# EAGLE design riffle-beta-0.1.3.2 (EAGLE 7.5.0)
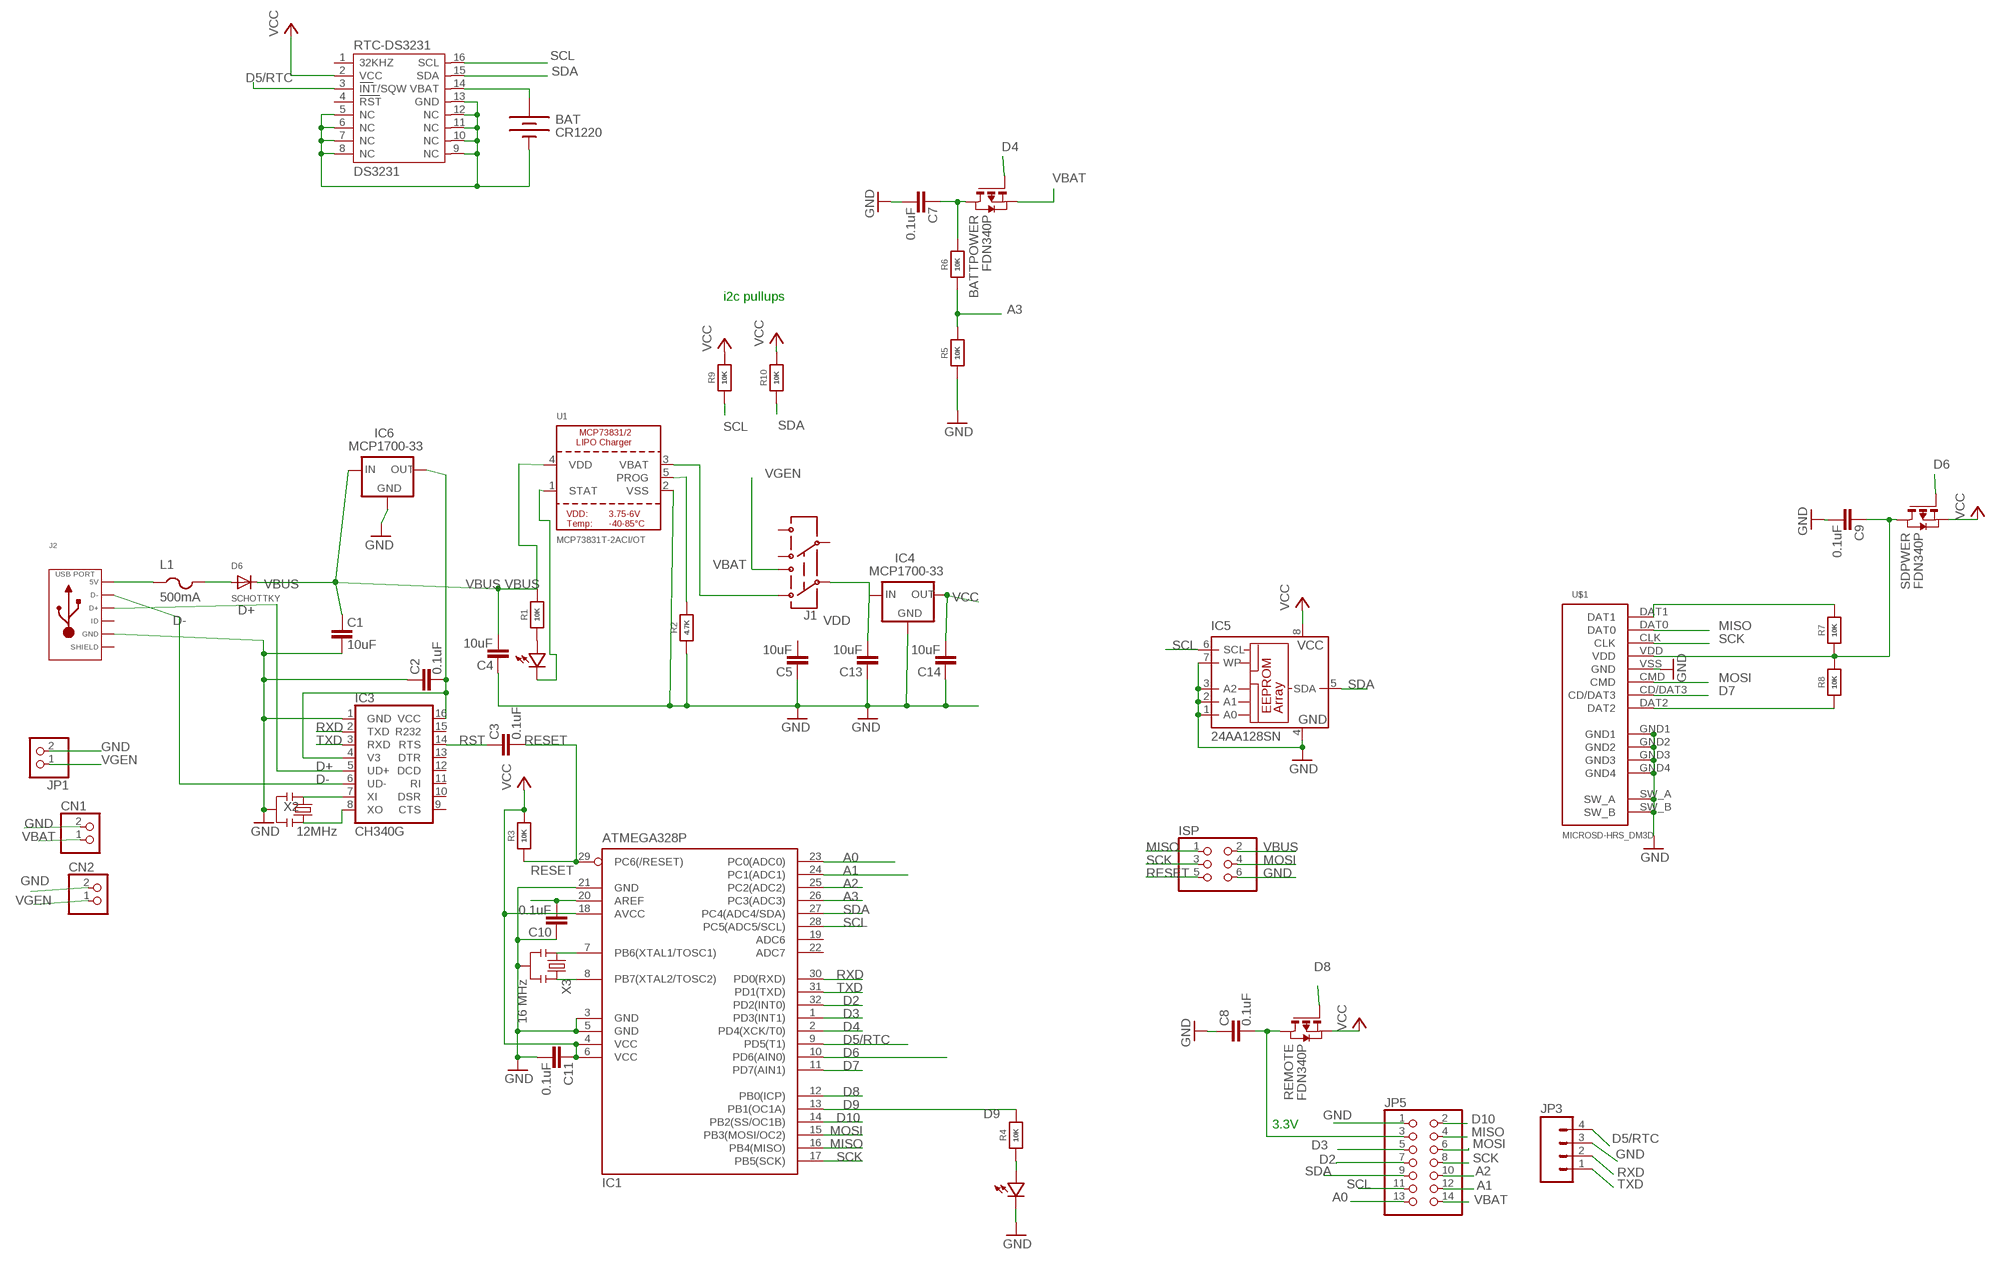
[diagram p0: schematic, sheet 1]

## Parts
BAT  CR1220  BATTERYBATTERY_12MM_SMT  [BATTCON_12MM_SMT]
BATTPOWER  FDN340P  PMOSSOT23  [SOT-23]
C1  10uF  CAP0603-CAP  [0603-CAP]
C2  0.1uF  CAP0603-CAP  [0603-CAP]
C3  0.1uF  CAP0603-CAP  [0603-CAP]
C4  10uF  CAP0603-CAP  [0603-CAP]
C5  10uF  CAP0603-CAP  [0603-CAP]
C7  0.1uF  CAP0603-CAP  [0603-CAP]
C8  0.1uF  CAP0603-CAP  [0603-CAP]
C9  0.1uF  CAP0603-CAP  [0603-CAP]
C10  0.1uF  CAP0603-CAP  [0603-CAP]
C11  0.1uF  CAP0603-CAP  [0603-CAP]
C13  10uF  CAP0603-CAP  [0603-CAP]
C14  10uF  CAP0603-CAP  [0603-CAP]
CN1  JST_2PIN-SMT-RA  [JST-PH-2-SMT-RA]
CN2  JST_2PIN-SMT-RA  [JST-PH-2-SMT-RA]
D1  LED0603  [0603-LED]
D2  LED0603  [0603-LED]
D6  SCHOTTKY  DIODE_SOD-123FL  [SOD-123FL]
IC1  ATMEGA328P  MEGA8-AI  [TQFP32-08]
IC3  CH340G  [SO16]
IC4  MCP1700-33  MCP1700SOT89  [SOT89]
IC5  24AA128SN  [SO-08]
IC6  MCP1700-33  MCP1700SOT89  [SOT89]
ISP  PINHD-2X3  [2X03]
J1  AYZ0202  [AYZ0202]
J2  USB_MICRO_RIGHT  [MICROUSB-RIGHT]
JP1  PINHD-1X2  [1X02]
JP3  M04SMD  [1X04-SMD]
JP5  PINHD-2X7  [2X07]
L1  500mA  PTCFUSE-1206  [R1206]
R1  10K  RESISTOR_0603_NOOUT  [0603-NO]
R2  4.7K  RESISTOR_0603_NOOUT  [0603-NO]
R3  10K  RESISTOR_0603_NOOUT  [0603-NO]
R4  10K  RESISTOR_0603_NOOUT  [0603-NO]
R5  10K  RESISTOR_0603_NOOUT  [0603-NO]
R6  10K  RESISTOR_0603_NOOUT  [0603-NO]
R7  10K  RESISTOR_0603_NOOUT  [0603-NO]
R8  10K  RESISTOR_0603_NOOUT  [0603-NO]
R9  10K  RESISTOR_0603_NOOUT  [0603-NO]
R10  10K  RESISTOR_0603_NOOUT  [0603-NO]
REMOTE  FDN340P  PMOSSOT23  [SOT-23]
RTC-DS3231  DS3231  [DS3231]
SDPWER  FDN340P  PMOSSOT23  [SOT-23]
U1  MCP73831T-2ACI/OT  MCP73831/2  [SOT23-5]
U$1  MICROSD-HRS_DM3D  [DM3D]
X2  12MHz  RESONATORSMD  [RESONATOR-SMD]
X3  16 MHz  RESONATORSMD  [RESONATOR-SMD]

## Nets
A0: IC1.23(PC0(ADC0)) JP5.13
A1: IC1.24(PC1(ADC1)) JP5.12
A2: IC1.25(PC2(ADC2)) JP5.10
A3: IC1.26(PC3(ADC3)) R5.2 R6.1
AREF: C10.1 IC1.20(AREF)
D2: IC1.32(PD2(INT0)) JP5.7
D3: IC1.1(PD3(INT1)) JP5.5
D4: BATTPOWER.3(G) IC1.2(PD4(XCK/T0))
D5/RTC: IC1.9(PD5(T1)) JP3.4 RTC-DS3231.3(INT/SQW)
D6: IC1.10(PD6(AIN0)) SDPWER.3(G)
D7: IC1.11(PD7(AIN1)) U$1.CD/DAT3
D8: IC1.12(PB0(ICP)) REMOTE.3(G)
D9: IC1.13(PB1(OC1A)) R4.2
D10: IC1.14(PB2(SS/OC1B)) JP5.2
D+: IC3.5(UD+) J2.3(D+)
D-: IC3.6(UD-) J2.2(D-)
GND: BAT.P$1(-) C1.1 C2.2 C4.2 C5.2 C7.1 C8.2 C9.1 C10.2 C11.1 C13.2 C14.2 CN1.2 CN2.2 D2.MINUS IC1.3(GND) IC1.5(GND) IC1.21(GND) IC3.1(GND) IC4.1(GND) IC5.1(A0) IC5.2(A1) IC5.3(A2) IC5.4(GND) IC5.7(WP) IC6.1(GND) ISP.6 J2.5(GND) JP1.2 JP3.3 JP5.1 R2.1 R5.1 RTC-DS3231.5(NC) RTC-DS3231.6(NC) RTC-DS3231.7(NC) RTC-DS3231.8(NC) RTC-DS3231.9(NC) RTC-DS3231.10(NC) RTC-DS3231.11(NC) RTC-DS3231.12(NC) RTC-DS3231.13(GND) U1.2(VSS) U$1.GND1 U$1.GND2 U$1.GND3 U$1.GND4 U$1.SW_A U$1.SW_B U$1.VSS(GND) X2.2 X3.2
MISO: IC1.16(PB4(MISO)) ISP.1 JP5.4 U$1.DAT0
MOSI: IC1.15(PB3(MOSI/OC2)) ISP.4 JP5.6 U$1.CMD
N$1: D1.PLUS R1.1
N$2: IC1.7(PB6(XTAL1/TOSC1)) X3.1
N$3: IC1.8(PB7(XTAL2/TOSC2)) X3.3
N$4: C9.2 R7.1 R8.2 SDPWER.1(D) U$1.VDD
N$5: D1.MINUS U1.1(STAT)
N$6: R2.2 U1.5(PROG)
N$7: C8.1 JP5.3 REMOTE.1(D)
N$8: C2.1 IC3.4(V3) IC3.16(VCC) IC6.3(OUT)
N$9: J2.1(5V) L1.1
N$10: D6.A L1.2
N$11: IC3.7(XI) X2.1
N$13: IC3.8(XO) X2.3
N$15: BATTPOWER.1(D) C7.2 R6.2
N$16: R7.2 U$1.DAT1
N$17: D2.PLUS R4.1
N$18: R8.1 U$1.DAT2
RESET: C3.1 IC1.29(PC6(/RESET)) ISP.5 R3.1
RST: C3.2 IC3.14(RTS)
RTC_BATT: BAT.P$2(+) RTC-DS3231.14(VBAT)
RXD: IC1.30(PD0(RXD)) IC3.2(TXD) JP3.2
SCK: IC1.17(PB5(SCK)) ISP.3 JP5.8 U$1.CLK
SCL: IC1.28(PC5(ADC5/SCL)) IC5.6(SCL) JP5.11 R9.1 RTC-DS3231.16(SCL)
SDA: IC1.27(PC4(ADC4/SDA)) IC5.5(SDA) JP5.9 R10.1 RTC-DS3231.15(SDA)
TXD: IC1.31(PD1(TXD)) IC3.3(RXD) JP3.1
VBAT [vcc]: BATTPOWER.2(S) CN1.1 J1.3 JP5.14 U1.3(VBAT)
VBUS [vcc]: C1.2 C4.1 D6.C IC6.2(IN) ISP.2 R1.2 U1.4(VDD)
VCC: C11.2 C14.1 IC1.4(VCC) IC1.6(VCC) IC1.18(AVCC) IC4.3(OUT) IC5.8(VCC) R3.2 R9.2 R10.2 REMOTE.2(S) RTC-DS3231.2(VCC) SDPWER.2(S)
VDD: C13.1 IC4.2(IN) J1.2
VGEN: CN2.1 J1.1 JP1.1
Unconnected: C5.1 IC1.19(ADC6) IC1.22(ADC7) IC3.9(CTS) IC3.10(DSR) IC3.11(RI) IC3.12(DCD) IC3.13(DTR) IC3.15(R232) J1.4 J1.5 J1.6 J2.4(ID) RTC-DS3231.1(32KHZ) RTC-DS3231.4(RST)

## Notes on the sheet
- i2c pullups
- 3.3V

## Power pins joined to a net without a drawn wire
SLD: J2.S1(SLD) J2.S2(SLD) J2.S3(SLD) J2.S4(SLD) J2.S5(SLD) J2.S6(SLD) J2.S7(SLD) J2.S8(SLD)

## Library data of the parts
BAT = SparkFunNew:BATTERY: Battery Holders Various common sizes : AA, AAA, 20mm coin cell and 12mm coin cell.
BATTPOWER REMOTE SDPWER = zetex:PMOSSOT23: MOS FET; OC_FARNELL: unknown; OC_NEWARK: unknown
C1-C5 C7-C11 C13 C14 = SparkFun:CAP: Capacitor Standard 0603 ceramic capacitor, and 0.1" leaded capacitor.
CN1 CN2 = adafruit:JST_2PIN: JST 2-Pin Connectors of various flavors SMT-RA (S2B-PH-SM4) 4UConnector #17311 SMT (B2B-PH-SM4) THM-RA (S2B-PH) THM (B2B-PH)
D1 D2 = LowPowerLab:LED
D6 = adafruit:DIODE: Diode SMADIODE - SMA Surface Mount Package 20V 1A Schottky Diode Digikey: 641-1014-6-ND DO-1N4148 - Through Hole Small Current Diode SOD-123 20V 1 A (.5mV Vf) Schottky Diode - Digikey: MBRX120TPMSCT-ND SOD-323 10V 570mA (.38mV Vf, 3ns) Schottky Diode - Digikey: ZLLS410CT-ND SOD-523 30V 30mA Schottky Diode (RB751S-40TE61) - Digikey: RB751S-40TE61CT-ND SOT23-R/W - SOT23 Package (R = Solder Paste/Reflow Ovens, W = Hand-Soldering) BAT54Film 40V 300mA - Digikey: 497-7162-1-ND
IC1 = atmel:MEGA8: MICROCONTROLLER 8 Kbytes FLASH, 1 kbytes SRAM, 512 bytes EEPROM, USART, 6-channel 10 bit ADC, 2-channel 8 bit ADC Pin compatible with Atmega48, ATMega88, ATMega168 Source: avr.lbr; MPN: ATMEGA8-16AU; OC_FARNELL: 9171371; OC_NEWARK: 73M8863
IC3 = SparkFunNew:CH340
IC4 IC6 = adafruit:MCP1700: VOLTAGE REGULATOR
IC5 = microchip:24*: Serial EEPROM I2C; MF: MICROCHIP; MPN: 24AA128-I/SN; OC_FARNELL: unknown; OC_NEWARK: 92C6842
ISP = pinhead:PINHD-2X3: PIN HEADER
J1 = SparkFunNew:AYZ0202: SPDT Slide Switch Simple SMD single-pull double-throw slide switch. Good for less than 350mA power switch, switching UARTs between devices, etc. Spark Fun Electronics SKU : COM-00597
J2 = MF_Connectors:USB: Library: MF_Connectors Description: 5 Pin USB Connectors. SLD is the shield connection. Usually tied to ground through a small ferrite bead.
JP1 = pinhead:PINHD-1X2: PIN HEADER
JP3 = SparkFun:M04: Header 4 Standard 4-pin 0.1" header. Use with straight break away headers (SKU : PRT-00116), right angle break away headers (PRT-00553), swiss pins (PRT-00743), machine pins (PRT-00117), and female headers (PRT-00115). Molex polarized connector foot print use with SKU : PRT-08231 with associated crimp pins and housings.
JP5 = pinhead:PINHD-2X7: PIN HEADER
L1 = adafruit:PTCFUSE: PTC fuses, resettable thermistors
R1-R10 = microbuilder:RESISTOR: Resistors For new designs, use the packages preceded by an '_' character since they are more reliable: The following footprints should be used on most boards: _0402 - Standard footprint for regular board layouts _0603 - Standard footprint for regular board layouts _0805 - Standard footprint for regular board layouts _1206 - Standard footprint for regular board layouts For extremely tight-pitch boards where space is at a premium, the following 'micro-pitch' footprints can be used (smaller pads, no silkscreen outline, etc.): _0402MP - Micro-pitch footprint for very dense/compact boards _0603MP - Micro-pitch footprint for very dense/compact boards _0805MP - Micro-pitch footprint for very dense/compact boards _1206MP - Micro-pitch footprint for very dense/compact boards
RTC-DS3231 = _lh-library:DS3231
U1 = microbuilder:MCP73831/2: MCP73831/2 LIPO Charger VDD: 3.75 - 6V Temp -40 - 85°C Programmable Charge Rate: 15-500mA NOTE: STAT is a tri-state logic output on the MCP73831 and an open-drain output on the MCP73832. SOT23-5 with 4.2V output and tri-state logic on STAT = MCP73831T-2ACI/OT
U$1 = hrs_DM3D-SF:MICROSD-HRS_DM3D
X2 = SparkFunNew:RESONATOR: Resonator Small SMD resonator. This is the itty bitty 10/20MHz resonators with built in caps. CSTCE10M0G55 and CSTCE20M0V53. Footprint has been reviewed closely but hasn't been tested yet.
X3 = SparkFun:RESONATOR: Resonator Small SMD resonator. This is the itty bitty 10/20MHz resonators with built in caps. CSTCE10M0G55 and CSTCE20M0V53. Footprint has been reviewed closely but hasn't been tested yet.

## Board
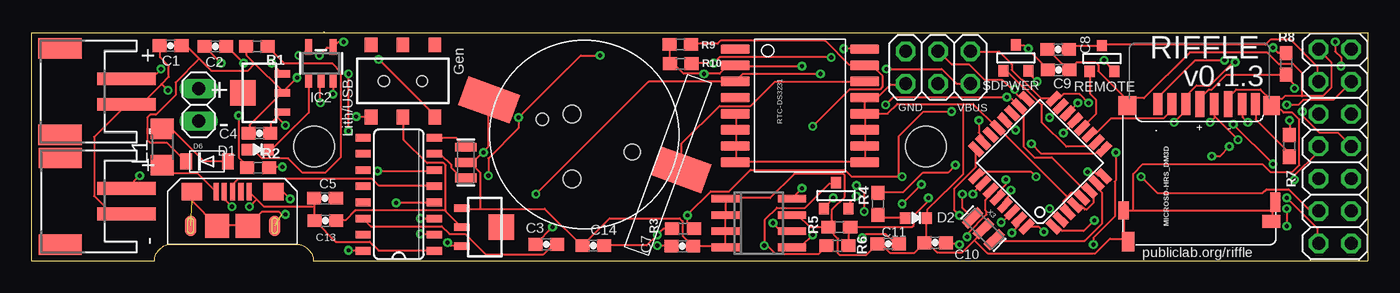
[diagram p1: board, top side]
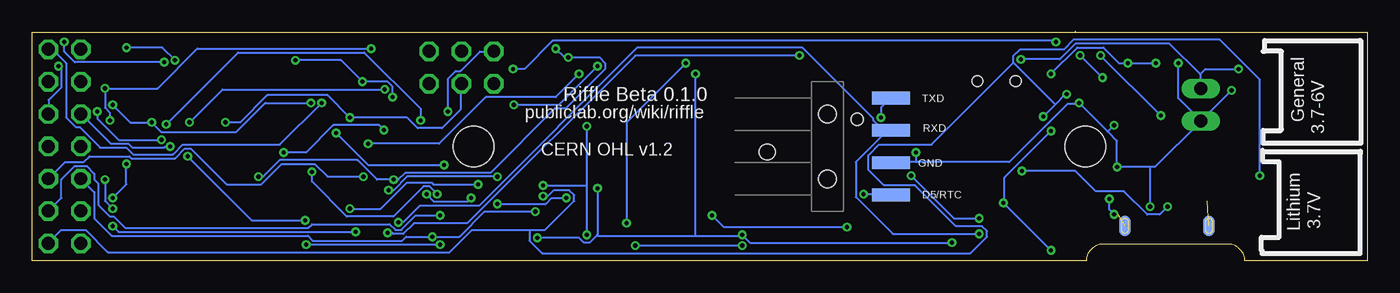
[diagram p2: board, bottom side, seen from below]

Size 104.8 x 18.01 mm. Coordinates in mm from the lower left corner, seen from the top.
Outline: 22.91,18.01 22.96,18.01
Outline: 0,0 0,17.96 104.8,17.96 104.8,0 22.07,0 arc90 20.75,1.32 10.95,1.32 arc90 9.63,0 0,0
Copper layers (1*16): Top 0.0356mm / dielectric 1.5011mm / Bottom 0.0356mm
Design rules "LaenPCBOrder": minimum track width 6mil, minimum drill 13mil, track to track 6mil, track to pad 6mil, pad to pad 6mil, via to via 6mil, smd to smd 6mil, copper to edge 15mil, drill to drill 6mil, minimum pad ring 7mil, minimum via ring 7mil, stop-mask expansion 3mil, vias tented up to drill 0mil, thermal gap 10mil
Holes 3.2 mm at 70.13,9 22.13,9

### Footprints (pad centres in the part's own frame; a part is rotated, then mirrored left to right if it is on the bottom)
BATTCON_12MM_SMT = smd 2.4 x 4.3: P$1 0,11.96 | smd 2.4 x 4.2: P$2 0,-4.1 | hole 0.95: 0,7.5 | hole 1.25: 0,0
SOT-23 = smd 0.787 x 0.889: 1 0.025,-1.016; 2 -0.94,1.016; 3 0.991,1.016
0603-CAP = smd 1.1 x 1: 1 -0.85,0; 2 0.85,0
JST-PH-2-SMT-RA = smd 1 x 4.6: 1 1,-3.7; 2 -1,-3.7 | smd 1.6 x 3.4: NC1 -3.4,1.5; NC2 3.4,1.5
0603-LED = smd 0.8 x 0.9: MINUS -0.85,0; PLUS 0.85,0
SOD-123FL = smd 0.91 x 1.22: A 1.637,0; C -1.637,0
TQFP32-08 = smd 1.27 x 0.559: 1 -4.293,2.8; 2 -4.293,2; 3 -4.293,1.2; 4 -4.293,0.4; 5 -4.293,-0.4; 6 -4.293,-1.2; 7 -4.293,-2; 8 -4.293,-2.8; 17 4.293,-2.8; 18 4.293,-2; 19 4.293,-1.2; 20 4.293,-0.4; 21 4.293,0.4; 22 4.293,1.2; 23 4.293,2; 24 4.293,2.8 | smd 0.559 x 1.27: 9 -2.8,-4.293; 10 -2,-4.293; 11 -1.2,-4.293; 12 -0.4,-4.293; 13 0.4,-4.293; 14 1.2,-4.293; 15 2,-4.293; 16 2.8,-4.293; 25 2.8,4.293; 26 2,4.293; 27 1.2,4.293; 28 0.4,4.293; 29 -0.4,4.293; 30 -1.2,4.293; 31 -2,4.293; 32 -2.8,4.293
SO16 = smd 0.6 x 1.2: 1 -4.445,-2.8; 2 -3.175,-2.8; 3 -1.905,-2.8; 4 -0.635,-2.8; 5 0.635,-2.8; 6 1.905,-2.8; 7 3.175,-2.8; 8 4.445,-2.8; 9 4.445,2.8; 10 3.175,2.8; 11 1.905,2.8; 12 0.635,2.8; 13 -0.635,2.8; 14 -1.905,2.8; 15 -3.175,2.8; 16 -4.445,2.8
SOT89 = smd 0.58 x 1.2: 1 -1.5,-1.8; 2 0,-1.8; 3 1.5,-1.8 | smd 2 x 2: 4 0,1.3
SO-08 = smd 0.6 x 2.2: 1 -1.905,-2.6; 2 -0.635,-2.6; 3 0.635,-2.6; 4 1.905,-2.6; 5 1.905,2.6; 6 0.635,2.6; 7 -0.635,2.6; 8 -1.905,2.6
2X03 = drill 1.016 octagon: 1 -2.54,-1.27; 2 -2.54,1.27; 3 0,-1.27; 4 0,1.27; 5 2.54,-1.27; 6 2.54,1.27
AYZ0202 = smd 1 x 1.15: 1 -2.5,2.825; 2 0,2.825; 3 2.5,2.825; 4 -2.5,-2.825; 5 0,-2.825; 6 2.5,-2.825 | hole 0.85: 1.5,0; -1.5,0
MICROUSB-RIGHT = smd 0.4 x 1.35: 1 -1.3,1.27; 2 -0.65,1.27; 3 0,1.27; 4 0.65,1.27; 5 1.3,1.27 | smd 0.9 x 1.6: S1 -3.3,-1.4; S2 3.3,-1.4 | smd 1.6 x 1.4: S3 -3.2,1.27; S4 3.2,1.27 | smd 1.9 x 1.9: S5 -1.2,-1.405; S6 1.2,-1.405 | smd 0.9 x 1.6 bottom: S7 -3.3,-1.4; S8 3.3,-1.4
1X02 = drill 1.016 long: 1 -1.27,0; 2 1.27,0
1X04-SMD = smd 1 x 3: 1 -3.81,5; 2 -1.27,5; 3 1.27,5; 4 3.81,5 | hole 1.4: -2.54,0; 2.54,0
2X07 = drill 1.016 octagon: 1 -7.62,-1.27; 2 -7.62,1.27; 3 -5.08,-1.27; 4 -5.08,1.27; 5 -2.54,-1.27; 6 -2.54,1.27; 7 0,-1.27; 8 0,1.27; 9 2.54,-1.27; 10 2.54,1.27; 11 5.08,-1.27; 12 5.08,1.27; 13 7.62,-1.27; 14 7.62,1.27
R1206 = smd 1.6 x 1.803: 1 -1.422,0; 2 1.422,0
0603-NO = smd 1.1 x 1: 1 -0.85,0; 2 0.85,0
DS3231 = smd 0.762 x 2.286: 1 -4.445,-5.08; 2 -3.175,-5.08; 3 -1.905,-5.08; 4 -0.635,-5.08; 5 0.635,-5.08; 6 1.905,-5.08; 7 3.175,-5.08; 8 4.445,-5.08; 9 4.445,5.08; 10 3.175,5.08; 11 1.905,5.08; 12 0.635,5.08; 13 -0.635,5.08; 14 -1.905,5.08; 15 -3.175,5.08; 16 -4.445,5.08
SOT23-5 = smd 0.55 x 1.2: 1 -0.95,-1.3; 2 0,-1.3; 3 0.95,-1.3; 4 0.95,1.3; 5 -0.95,1.3
DM3D = smd 0.7 x 1.75: CD/DAT3 8.15,0.45; CLK 4.85,0.45; CMD 7.05,0.45; DAT0 2.65,0.45; DAT1 1.6,0.45; DAT2 9.25,0.45 | smd 0.8 x 1.5: GND1 0.05,8.15 | smd 0.8 x 1.4: GND2 11.95,8.8 | smd 1.4 x 1.5: GND3 11.65,0.55 | smd 1.3 x 1.5: GND4 0.35,0.55 | smd 1 x 1.55: SW_A 11.6,11.25 | smd 1.4 x 1: SW_B 0.35,9.65 | smd 0.7 x 2.032: VDD 5.95,0.45; VSS 3.75,0.45
RESONATOR-SMD = smd 0.7 x 1.7: 1 -1.2,0; 2 0,0; 3 1.2,0

### Placement (x,y rotation side)
BAT  47.1,8.57 70 top
BATTPOWER  63.12,5.14 180 top
C1  10.88,16.92 0 top
C2  14.39,16.86 180 top
C3  40.37,1.31 0 top
C4  17.86,10.04 0 top
C5  23,4.94 180 top
C7  51.03,1.17 180 top
C8  80.53,16.62 180 top
C9  80.57,15.01 180 top
C10  70.86,1.44 180 top
C11  67.19,1.36 0 top
C13  23.04,3.17 180 top
C14  44.04,1.22 180 top
CN1  3.72,4.7 90 top
CN2  3.71,13.31 90 top
D1  17.72,8.76 180 top
D2  69.37,3.38 180 top
D6  13.74,7.82 0 top
IC1  79.09,7.72 135 top
IC3  28.79,5.24 90 top
IC4  35.53,2.67 270 top
IC5  57.02,2.98 270 top
IC6  17.86,13.21 90 top
ISP  71.1,15.2 180 top
J1  29.11,14.14 180 top
J2  15.75,4.17 0 top
JP1  13.09,12.26 270 top
JP3  42.39,9 270 bottom
JP5  102.23,9.01 270 top
L1  10.24,8.97 90 top
R1  17.66,16.87 180 top
R2  17.75,7.34 180 top
R3  51.09,2.55 180 top
R4  66.37,4.5 90 top
R5  63.35,2.66 0 top
R6  63.2,1.22 180 top
R7  98.65,9.05 270 top
R8  98.4,15.49 270 top
R9  50.91,15.5 180 top
R10  50.88,17.03 180 top
REMOTE  83.98,15.91 180 top
RTC-DS3231  60.27,12.21 270 top
SDPWER  77.23,15.95 180 top
U1  22.68,15.52 0 top
U$1  97.6,12.78 180 top
X2  34.06,7.74 90 top
X3  74.66,2.55 135 top

### Tracks (layer width: path | path; a pad name or v marks a point on that pad's centre or on a via)
A0  (via drill 0.33)
  Top 0.152: v74.29,11.05 74.29,10.06 74.6,9.75 74.6,9.37 IC1.23 | v97.38,7.62 v94.26,10.74 | v98.45,4.95 100.89,2.52 100.89,1.45 JP5.13
  Bottom 0.152: v74.29,11.05 74.29,11.96 78.71,16.38 88.62,16.38 v94.26,10.74 | v97.38,7.62 97.38,6.02 v98.45,4.95
A1  (via drill 0.33)
  Top 0.152: v72.77,3.58 72.39,3.96 72.39,5.71 74.07,7.39 74.07,8.76 IC1.24
  Bottom 0.152: v72.77,3.58 74.68,3.58 75.82,2.44 76.28,2.44 76.73,2.9 82.83,2.9 83.13,2.59 97.46,2.59 98.37,3.5 98.68,3.5 99.59,4.42 99.59,6.1 99.9,6.4 99.9,6.86 100.51,7.47 101.42,7.47 102.49,6.4 102.49,4.95 103.48,3.96 JP5.12
A2  (via drill 0.33)
  Top 0.152: v78.79,6.63 78.41,7.01 74.83,7.01 74.52,6.71 74.14,6.71 IC1.25
  Bottom 0.152: v78.79,6.63 81.61,6.63 82.6,7.62 85.19,7.62 86.79,6.02 89.53,6.02 92.35,8.84 92.81,8.84 93.57,8.08 97,8.08 97.15,8.23 100.28,8.23 100.74,7.77 102.18,7.77 103.48,6.48 JP5.10
A3  (via drill 0.33)
  Top 0.152: R6.1 64.08,1.22 64.08,2.52 64.16,2.59 R5.2 64.24,2.67 69.04,2.67 69.19,2.82 69.19,3.58 70.33,4.72 v70.33,4.95 | v73.84,5.26 73.84,5.33 74.6,6.1 IC1.26
  Bottom 0.152: v73.84,5.26 73.23,4.65 70.64,4.65 v70.33,4.95
AREF  (via drill 0.33)
  Top 0.152: v72.77,1.29 72.69,1.37 71.78,1.37 C10.1 | v83.29,1.29 83.29,1.83 84.96,3.5 84.96,6.25 85.04,6.33 v85.04,8.53 | v77.19,10.29 77.04,10.29 76.35,10.97 IC1.20
  Bottom 0.152: v83.29,1.29 v72.77,1.29 | v85.04,8.53 83.29,8.53 81.15,10.67 77.57,10.67 v77.19,10.29
D2  (via drill 0.33)
  Top 0.152: v79.4,2.29 79.02,2.67 78.1,2.67 IC1.32 | v98.45,4.12 v98.45,2.74 | v99.06,6.4 99.06,6.71 100.89,8.53 100.89,8.99 JP5.7
  Bottom 0.152: v79.4,2.29 97.99,2.29 v98.45,2.74 | v98.45,4.12 99.06,4.72 v99.06,6.4
D3  (via drill 0.33)
  Top 0.152: v83.36,3.2 82.52,2.36 80.85,2.36 80.54,2.67 80.16,2.67 IC1.1 | v92.58,8.23 93.19,8.23 v93.95,8.99
  Bottom 0.152: v83.36,3.2 87.55,3.2 v92.58,8.23 | v93.95,8.99 94.34,8.99 94.41,8.91 96.93,8.91 97.23,9.22 98.6,9.22 100.89,11.51 JP5.5
D4  (via drill 0.33)
  Top 0.152: v62.86,4.95 62.86,4.88 62.18,4.19 BATTPOWER.3 | v69.8,6.02 v68.28,4.5 | v79.86,4.12 80.7,3.28 IC1.2
  Bottom 0.152: v62.86,4.95 64.01,4.95 64.47,4.5 v68.28,4.5 | v69.8,6.02 73.3,6.02 73.46,6.17 75.36,6.17 77.42,4.12 v79.86,4.12
D5/RTC  (via drill 0.33)
  Top 0.152: v78.41,9.22 79.17,8.46 83.44,8.46 83.74,8.76 84.05,8.76 IC1.9 | v61.87,14.71 55.78,14.71 55.24,14.17 RTC-DS3231.3 55.17,14.1 48.39,14.1 v39.55,5.26
  Bottom 0.152: v78.41,9.22 72.85,9.22 69.19,12.88 63.7,12.88 v61.87,14.71 | v39.55,5.26 37.41,5.26 JP3.4
D6
  Top 0.152: SDPWER.3 76.28,14.94 76.5,14.94 77.8,13.64 77.88,13.64 79.25,12.27 79.25,10.9 81.15,8.99 83.21,8.99 83.52,9.3 IC1.10
D7
  Top 0.152: IC1.11 82.98,9.98 83.44,9.98 84.66,11.2 88.77,11.2 89.38,11.81 89.38,12.27 U$1.CD/DAT3
D8
  Top 0.152: REMOTE.3 83.06,14.86 83.06,13.11 83.52,12.65 83.52,11.58 82.45,10.52 IC1.12
D9  (via drill 0.33)
  Top 0.152: v72.47,7.54 71.86,6.93 69.88,6.93 68.35,5.41 66.45,5.41 R4.2 | v80.92,10.06 81.84,10.97 IC1.13
  Bottom 0.152: v72.47,7.54 78.41,7.54 v80.92,10.06
D10  (via drill 0.33)
  Top 0.152: v82.07,12.42 81.31,11.66 IC1.14
  Bottom 0.152: v82.07,12.42 85.34,9.14 92.96,9.14 93.73,8.38 96.85,8.38 97.38,8.91 99.44,8.91 101.04,10.52 101.35,10.52 102.11,11.28 102.11,15.54 103.17,16.61 103.48,16.61 JP5.2
D+
  Top 0.152: IC3.5 31.55,5.94 27.2,5.94 26.67,6.48 16.23,6.48 15.77,6.02 15.77,5.49 J2.3
D-  (via drill 0.33)
  Top 0.152: v27.13,7.09 31.55,7.09 IC3.6 | v15.7,4.27 15.16,4.8 15.16,5.41 J2.2
  Bottom 0.152: v27.13,7.09 22.94,7.09 21.34,5.49 19.13,5.49 17.3,3.66 16.31,3.66 v15.7,4.27
GND  (via drill 0.33)
  Top 0.152: 10.17,13.91 8.61,12.34 7.47,12.34 CN2.2 7.39,12.27 4.88,9.75 4.88,5.11 6.25,3.73 7.39,3.73 CN1.2 | 10.17,13.91 10.74,14.48 10.74,15.32 10.06,16 10.06,16.92 C1.1 | 31.62,0.84 IC3.1 31.55,0.84 27.2,0.84 26.52,1.52 23.85,1.52 22.25,3.12 C13.2 22.17,3.2 22.17,4.27 | 22.17,4.27 22.17,4.88 C5.2 | 17.64,4.84 18.21,4.27 22.17,4.27 | 17.64,4.84 17.07,5.41 J2.5 | 19.24,11.32 19.58,11.66 IC6.1 | 19.24,11.32 18.75,10.82 18.75,10.06 C4.2 | v19.66,7.39 18.67,7.39 R2.1 | v14.86,15.54 13.56,16.84 C2.2 | v22.63,12.42 22.63,14.17 U1.2 | v19.89,10.67 19.24,11.32 | v17.07,4.27 17.64,4.84 | v10.67,13.41 10.17,13.91 | 75.74,10.52 IC1.21 | 81.23,5.03 81.53,5.33 82.07,5.33 82.37,5.03 IC1.5 | 81.23,5.03 80.92,4.72 80.92,4.57 81.23,4.27 81.23,3.89 IC1.3 | 81.23,5.03 75.82,10.44 IC1.21 | RTC-DS3231.5 55.24,11.51 55.24,10.36 RTC-DS3231.6 55.24,10.29 55.24,9.07 RTC-DS3231.7 55.24,8.99 55.24,7.77 RTC-DS3231.8 55.32,7.77 65.3,7.77 RTC-DS3231.9 65.38,7.77 65.38,8.99 RTC-DS3231.10 65.38,9.07 65.38,10.29 RTC-DS3231.11 65.38,10.36 65.38,11.51 RTC-DS3231.12 | RTC-DS3231.12 65.38,11.58 65.38,12.8 RTC-DS3231.13 65.46,12.8 66.29,12.8 67.36,13.87 68.5,13.87 ISP.6 | 73.08,12.34 67.89,12.34 67.13,11.58 65.46,11.58 RTC-DS3231.12 | 73.08,12.34 73.84,12.34 75.67,10.52 IC1.21 | IC5.4 54.41,1.14 51.89,1.14 C7.1 51.82,1.22 51.05,1.98 51.05,3.12 50.83,3.35 45.34,3.35 43.21,1.22 C14.2 43.13,1.22 40.23,4.12 35.2,4.12 | 54.41,1.07 IC5.4 | IC5.4 54.41,1.22 54.41,2.29 IC5.3 54.41,2.36 54.41,3.58 IC5.2 54.41,3.66 54.41,4.88 IC5.1 54.48,4.95 57.91,4.95 59.82,6.86 63.63,6.86 63.78,6.71 63.78,5.03 62.79,4.04 62.79,3.05 62.48,2.74 R5.1
  Top 0.152: 35.2,4.12 33.76,4.12 IC4.1 | 35.2,4.12 35.2,6.93 34.44,7.7 34.06,7.7 X2.2 34.52,7.7 35.39,8.57 | 35.39,8.57 35.81,8.99 35.81,12.65 BAT.P$1 | C8.2 79.71,16.61 81.23,15.09 81.38,15.09 C9.1 81.46,15.09 81.99,15.62 83.44,15.62 83.67,15.39 83.67,14.94 85.88,12.72 85.88,12.27 U$1.GND3 85.88,12.8 87.25,12.8 90.83,16.38 96.93,16.38 97.84,15.47 98.98,15.47 99.67,14.78 99.67,12.95 | U$1.GND4 97.23,12.27 97.23,12.65 96.39,13.49 94.49,13.49 93.88,12.88 93.88,12.34 U$1.VSS | 99.67,12.95 101.27,12.95 101.96,13.64 101.96,15.62 100.96,16.61 JP5.1 | 99.67,12.95 98.3,12.95 98.07,12.72 97.23,12.72 U$1.GND4 | 97.31,3.96 97.31,4.34 97.54,4.57 U$1.GND1 97.31,3.96 | 97.31,3.96 97.31,3.2 U$1.SW_B | 86.41,3.96 85.8,3.96 U$1.GND2 85.72,3.96 85.72,1.83 85.95,1.6 U$1.SW_A 85.72,1.75 84.58,1.75 83.44,0.61 74.98,0.61 73.95,1.64 | 86.41,3.96 97.31,3.96 | R5.1 62.48,2.67 61.04,2.67 60.12,3.58 59.66,3.58 IC5.7 | C10.2 70.03,1.45 70.18,1.6 70.18,3.35 D2.MINUS 70.26,3.43 70.26,4.04 73.08,6.86 73.08,12.34 | C10.2 69.95,1.37 69.19,0.61 67.36,0.61 66.67,1.29 66.37,1.29 C11.1 66.29,1.29 65.46,0.46 63.4,0.46 63.25,0.61 63.25,1.75 62.56,2.44 62.56,2.59 R5.1 | 73.95,1.64 73,0.69 71.02,0.69 70.18,1.52 C10.2 | 73.95,1.64 74.6,2.29 74.6,2.52 X3.2 | 86.41,3.96 86.41,6.86 87.17,7.62 96.55,7.62 97.15,7.01 98.91,7.01 99.44,7.54 99.44,11.12 98.91,11.66 98.22,11.66 97.69,12.19 97.31,12.19 U$1.GND4 | v35.43,8.53 35.39,8.57
  Bottom 0.152: 17.07,7.39 16.69,7.39 13.11,10.97 JP1.2 | 17.07,7.39 v19.66,7.39 19.66,9.45 20.38,10.17 | v14.86,15.54 14.86,12.8 13.11,11.05 JP1.2 | 20.38,10.17 v22.63,12.42 22.63,12.34 23.55,12.34 28.12,7.77 35.43,7.77 | 20.38,10.17 v19.89,10.67 | 35.43,7.77 37.34,7.77 JP3.3 | 17.07,7.39 v17.07,4.27 | v10.67,13.41 13.03,11.05 JP1.2 | v35.43,8.53 35.43,7.77
MISO  (via drill 0.33)
  Top 0.152: ISP.1 73.69,16.46 75.9,16.46 76.89,15.47 76.89,15.01 77.65,14.25 77.72,14.25 79.17,12.8 80.09,12.8 IC1.16 80.16,12.8 80.62,12.8 80.92,13.11 82.22,13.11 v82.91,12.42 | v95.4,10.9 95.02,11.28 95.02,12.27 U$1.DAT0 | v98.45,12.27 99.36,12.27 99.75,12.65 102.11,12.65 103.48,14.02 JP5.4
  Bottom 0.152: v98.45,12.27 97.08,10.9 v95.4,10.9 94.64,10.13 88.77,10.13 86.49,12.42 v82.91,12.42
MOSI  (via drill 0.33)
  Top 0.152: v79.86,11.28 80.7,12.12 IC1.15 | v89.61,10.9 90.53,11.81 90.53,12.27 U$1.CMD 90.6,12.34 90.6,13.03 91.36,13.79 92.43,13.79 94.26,15.62 v94.41,15.62 | v102.72,15.32 102.72,16 102.26,16.46 v102.26,17.22
  Bottom 0.152: ISP.4 71.17,13.87 71.17,11.89 72.62,10.44 74.52,10.44 75.36,11.28 v79.86,11.28 81.61,13.03 86.33,13.03 88.47,10.9 v89.61,10.9 | v102.72,15.32 102.49,15.09 102.49,13.64 103.48,12.65 103.48,11.58 JP5.6 | v102.26,17.22 102.26,16.46 101.42,15.62 v94.41,15.62
N$1
  Top 0.152: D1.PLUS 16.92,8.69 17.45,8.69 18.06,8.08 20.12,8.08 21.26,6.93 23.01,6.93 24.23,8.15 24.23,14.86 23.55,15.54 19.81,15.54 18.52,16.84 R1.1
N$2
  Top 0.152: IC1.7 83.59,6.1 83.59,5.71 83.97,5.33 83.97,2.97 82.6,1.6 75.59,1.6 75.51,1.68 X3.1
N$3  (via drill 0.33)
  Top 0.152: v82.83,7.01 83.36,7.01 83.67,6.71 84.05,6.71 IC1.8 | v73,5.26 73,4.19 73.76,3.43 X3.3
  Bottom 0.152: v82.83,7.01 82.83,6.25 80.09,3.5 76.43,3.5 74.07,5.87 73.61,5.87 v73,5.26
N$4  (via drill 0.33)
  Top 0.152: 78.14,16.65 79.71,15.09 C9.2 | 78.14,16.65 77.88,16.92 77.27,16.92 SDPWER.1 | U$1.VDD 91.67,12.34 91.67,12.8 92.35,13.49 92.58,13.49 93.73,14.63 98.37,14.63 R8.2 98.37,14.55 99.06,13.87 v99.06,13.56 | v98.68,11.05 98.68,9.91 R7.1 | v78.18,16.69 78.14,16.65
  Bottom 0.152: v98.68,11.05 98.68,11.66 99.06,12.04 v99.06,13.56 94.95,13.56 91.82,16.69 v78.18,16.69
N$5
  Top 0.152: D1.MINUS 18.59,8.76 18.82,8.76 21.72,11.66 21.72,14.17 U1.1
N$6  (via drill 0.33)
  Top 0.152: v16.23,11.43 16.23,8.15 16.84,7.54 16.84,7.39 R2.2 | v20.95,16.15 21.11,16.15 21.72,16.76 U1.5
  Bottom 0.152: v20.95,16.15 v16.23,11.43
N$7
  Top 0.152: C8.1 81.38,16.69 81.61,16.92 83.9,16.92 REMOTE.1 83.97,16.99 96.77,16.99 97.15,17.37 98.76,17.37 100.89,15.24 100.89,14.1 JP5.3
N$8  (via drill 0.33)
  Top 0.152: v16.61,15.54 15.32,16.84 C2.1 | v18.82,15.54 19.58,14.78 IC6.3 | v24.84,0.84 25.98,0.84 IC3.16 | v28.57,4.57 31.55,4.57 IC3.4 | v24.84,10.21 v24.84,14.71
  Bottom 0.152: v16.61,15.54 v18.82,15.54 19.51,15.54 20.73,16.76 22.78,16.76 v24.84,14.71 | v24.84,0.84 v28.57,4.57 28.5,4.57 28.5,6.55 v24.84,10.21
N$9
  Top 0.152: J2.1 14.4,5.49 12.95,6.93 10.9,6.93 10.29,7.54 L1.1
N$10
  Top 0.152: D6.A 15.32,7.85 13.49,7.85 10.97,10.36 10.29,10.36 L1.2
N$11
  Top 0.152: IC3.7 31.62,8.38 32.08,8.38 32.92,7.54 32.92,7.32 33.68,6.55 33.99,6.55 X2.1
N$13
  Top 0.152: IC3.8 31.62,9.68 33.3,9.68 33.99,8.99 X2.3
N$15  (via drill 0.33)
  Top 0.152: 57.57,1.33 58.37,0.53 61.72,0.53 62.33,1.14 R6.2 | 57.57,1.33 57.53,1.37 57.53,3.28 58.45,4.19 60.66,4.19 62.56,6.1 63.09,6.1 BATTPOWER.1 | v49.07,1.22 50.14,1.22 C7.2 | 57.57,1.33 v57.45,1.22
  Bottom 0.152: v57.45,1.22 v49.07,1.22
N$16
  Top 0.152: R7.2 98.6,8.23 98.6,8.53 96.01,11.12 96.01,12.27 U$1.DAT1
N$17
  Top 0.152: D2.PLUS 68.5,3.43 66.6,3.43 66.45,3.58 R4.1
N$18  (via drill 0.33)
  Top 0.152: v97.38,16.76 97.76,16.38 98.37,16.38 R8.1 | v93.57,15.77 91.29,15.77 88.39,12.88 88.39,12.34 U$1.DAT2
  Bottom 0.152: v97.38,16.76 94.56,16.76 v93.57,15.77
RESET  (via drill 0.33)
  Top 0.152: v40.84,2.67 39.55,1.37 C3.1 | R3.1 51.89,2.59 51.43,3.05 v51.43,3.58 51.43,3.66 53.26,5.49 54.71,5.49 56.39,7.16 63.78,7.16 64.31,6.63 68.05,6.63 | v76.81,5.56 76.81,5.26 76.35,4.8 76.35,4.42 IC1.29 | v72.16,11.73 69.95,11.73 68.05,9.83 68.05,6.63 | 68.05,6.63 v68.28,6.63
  Bottom 0.152: v40.84,2.67 50.52,2.67 v51.43,3.58 | v76.81,5.56 76.43,5.56 75.36,6.63 v68.28,6.63 | v72.16,11.73 72.16,14.33 71.55,14.94 71.17,14.94 69.65,16.46 68.58,16.46 ISP.5
RST
  Top 0.152: C3.2 41.15,1.29 40.92,1.29 40.16,0.53 35.59,0.53 33.99,2.13 32.77,2.13 32.16,2.74 26.59,2.74 26.06,3.28 IC3.14
RTC_BATT
  Top 0.152: RTC-DS3231.14 65.3,14.1 58.29,14.1 56.39,12.19 53.95,12.19 50.98,9.22 50.98,7.24 BAT.P$2
RXD  (via drill 0.33)
  Top 0.152: v30.48,2.13 31.55,2.13 IC3.2 | v76.05,3.05 76.12,3.05 76.89,3.81 IC1.30
  Bottom 0.152: v30.48,2.13 37.26,2.13 40.16,5.03 40.16,7.77 37.72,10.21 37.41,10.21 JP3.2 37.87,10.13 38.79,11.05 38.79,11.2 44.35,16.76 57.3,16.76 69.72,4.34 74.37,4.34 75.67,3.05 v76.05,3.05
SCK  (via drill 0.33)
  Top 0.152: 77,13.37 76.12,14.25 74.75,14.25 73.53,15.47 72.16,15.47 71.17,16.46 ISP.3 | 77,13.37 77.57,12.8 78.03,12.8 IC1.17 | v94.64,9.53 92.85,11.32 | 92.85,11.32 92.81,11.35 92.81,12.27 U$1.CLK | v99.67,11.73 99.67,11.43 101.04,10.06 102.49,10.06 103.48,9.07 JP5.8 | v77.11,13.49 77,13.37 | 92.85,11.32 v92.43,10.9
  Bottom 0.152: v94.64,9.53 97.99,9.53 99.67,11.2 v99.67,11.73 | v77.11,13.49 89.84,13.49 v92.43,10.9
SCL  (via drill 0.33)
  Top 0.152: v62.71,16 53.95,16 v53.49,15.54 51.82,15.54 R9.1 | v63.7,16.69 65.3,16.69 RTC-DS3231.16 | v76.43,6.4 76.43,6.02 75.82,5.41 75.82,5.03 IC1.28 | v58.14,2.97 58.75,2.36 59.59,2.36 IC5.6 | v87.02,6.63 88.32,5.33 96.55,5.33 96.85,5.64 98.6,5.64 100.28,3.96 100.89,3.96 JP5.11
  Bottom 0.152: v63.7,16.69 63.02,16 v62.71,16 60.27,16 59.82,15.54 59.82,15.09 62.94,11.96 63.78,11.96 68.81,6.93 75.51,6.93 76.05,6.4 v76.43,6.4 77.72,6.4 79.25,7.92 85.34,7.92 86.64,6.63 v87.02,6.63 | v58.14,2.97 58.14,10.9 v53.49,15.54
SDA  (via drill 0.33)
  Top 0.152: R10.1 51.74,17.07 53.8,17.07 54.03,17.3 62.26,17.3 64.16,15.39 65.3,15.39 RTC-DS3231.15 65.38,15.32 65.99,15.32 66.75,14.55 66.75,13.72 66.52,13.49 64.16,13.49 v61.26,10.59 | v61.26,2.06 60.35,1.14 59.66,1.14 IC5.5 | v73.38,1.91 73.38,2.13 74.9,3.66 74.9,3.89 74.83,3.96 74.83,4.8 75.13,5.11 75.13,5.49 IC1.27 | v64.69,5.94 65.3,5.33 v65.3,3.89
  Bottom 0.152: v61.26,10.59 61.26,5.94 | 61.26,5.94 v61.26,2.06 | JP5.9 100.89,6.4 99.9,5.41 99.9,3.35 98.53,1.98 83.13,1.98 82.75,1.6 75.74,1.6 75.44,1.91 v73.38,1.91 71.25,1.91 69.27,3.89 v65.3,3.89 | v64.69,5.94 61.26,5.94
SLD  (via drill 0.33)  (4 unrouted)
  Top 0.152: J2.S3 12.57,5.41 12.57,4.72 14.48,2.82 J2.S5 14.55,2.82 16.92,2.82 J2.S6 16.99,2.82 18.06,3.89 19.35,3.89 19.58,3.66 v19.89,3.66 | v20.27,4.88 19.74,5.41 18.97,5.41 J2.S4
  Bottom 0.152: v20.27,4.88 20.27,4.04 v19.89,3.66
TXD  (via drill 0.33)
  Top 0.152: v30.48,3.35 31.55,3.35 IC3.3 | v35.81,6.71 35.81,8.08 38.18,10.44 v38.18,11.28 43.05,16.15 v44.58,16.15 | v76.89,2.21 76.89,2.29 77.42,2.82 77.42,3.2 IC1.31
  Bottom 0.152: v30.48,3.35 32.46,3.35 v35.81,6.71 | v38.18,11.28 38.18,12.04 37.41,12.8 JP3.1 | v76.89,2.21 76.5,2.21 76.43,2.13 75.67,2.13 74.83,2.97 70.64,2.97 57.45,16.15 v44.58,16.15
VBAT  (via drill 0.33)
  Top 0.152: v25.45,11.35 26.59,11.35 J1.3 | v23.62,13.11 23.62,14.17 U1.3 | v8.46,6.71 7.47,5.71 CN1.1 | v64.69,5.11 64.08,4.5 64.08,4.19 BATTPOWER.2
  Bottom 0.152: 24.5,12.31 23.7,13.11 v23.62,13.11 | 24.5,12.31 v25.45,11.35 | 27.77,15.58 27.81,15.62 27.81,16.08 27.28,16.61 23.85,16.61 23.09,17.37 11.58,17.37 8.46,14.25 v8.46,6.71 | 27.77,15.58 24.5,12.31 | v64.69,5.11 64.31,5.11 63.86,5.56 62.64,5.56 62.26,5.18 62.26,4.72 64.54,2.44 65.76,2.44 | 65.76,2.44 70.26,2.44 72.01,0.69 98.83,0.69 100.58,2.44 102.49,2.44 103.48,1.45 JP5.14 | 27.77,15.58 34.21,9.14 38.33,9.14 39.17,8.31 39.17,7.16 37.95,5.94 35.51,5.94 32.31,2.74 30.25,2.74 29.87,2.36 29.87,1.91 31.17,0.61 64.77,0.61 65.76,1.6 65.76,2.44
VBUS  (via drill 0.33)
  Top 0.152: C4.1 17.07,10.06 17.07,10.67 19.58,13.18 IC6.2 | 17.49,15.51 19.58,13.41 19.58,13.26 IC6.2 | 17.49,15.51 16.84,16.15 16.84,16.84 R1.2 | 13.14,15.89 14.1,14.94 16.92,14.94 17.49,15.51 | 13.14,15.89 12.12,16.92 C1.2 | v22.56,16.15 23.16,16.76 23.62,16.76 U1.4 23.7,16.84 24.08,17.22 v24.46,17.22 | v20.8,14.4 19.66,13.26 IC6.2 | 13.14,15.89 11.28,14.02 11.28,13.03 9.75,11.51 9.3,11.51 9.07,11.28 9.07,9.53 9.3,9.3 10.59,9.3 12.04,7.85 D6.C | v67.06,15.09 71.4,15.09 72.54,13.95 73.61,13.95 ISP.2
  Bottom 0.152: v20.8,14.4 v22.56,16.15 | v67.06,15.09 66.14,15.09 63.93,17.3 24.54,17.3 v24.46,17.22
VCC  (via drill 0.33)
  Top 0.152: IC1.4 81.91,4.34 82.3,4.34 82.6,4.04 82.75,4.04 83.29,4.57 83.29,5.18 82.98,5.49 IC1.6 82.91,5.56 82.6,5.56 80.01,8.15 78.64,8.15 77.8,8.99 77.8,11.81 77.5,12.12 IC1.18 77.42,12.19 76.73,12.88 v76.5,12.88 67.59,12.88 v66.98,12.27 | v78.87,14.1 78.18,14.78 78.18,14.94 SDPWER.2 | v84.12,15.77 84.12,15.7 84.89,14.94 REMOTE.2 | R10.2 50.06,16.99 50.06,15.54 R9.2 50.14,15.54 50.29,15.54 51.13,14.71 v52.73,14.71 53.95,14.71 54.56,15.32 55.17,15.32 RTC-DS3231.2 55.24,15.32 v60.43,15.32 | C14.1 48.23,1.22 v49.07,2.06 49.53,2.52 50.22,2.52 R3.2 | v65.15,1.83 65.46,2.13 66.98,2.13 67.74,1.37 67.97,1.37 C11.2 | v60.43,5.71 59.66,4.95 IC5.8 59.59,4.88 | v32.61,1.45 32.84,1.22 33.68,1.22 IC4.3
  Bottom 0.152: v76.5,12.88 76.5,13.72 76.89,14.1 v78.87,14.1 80.54,15.77 v84.12,15.77 | v65.15,1.83 61.87,1.83 61.49,1.45 61.04,1.45 60.46,2.02 | 60.46,2.02 60.43,2.06 v60.43,5.71 | v32.61,1.45 48.46,1.45 49,1.98 49.07,1.98 | 52.73,1.98 60.43,1.98 60.46,2.02 | 52.73,1.98 49.07,1.98 | 49.07,1.98 v49.07,2.06 | 52.73,1.98 v52.73,14.71 | v66.98,12.27 63.47,12.27 v60.43,15.32
VDD
  Top 0.152: 32.42,3.92 33.68,2.67 IC4.2 | 32.42,3.92 32.38,3.96 25.37,3.96 24.61,3.2 23.93,3.2 C13.1 | J1.2 29.18,11.28 29.18,9.53 31.01,7.7 32.31,7.7 32.46,7.54 32.46,3.96 32.42,3.92
VGEN  (via drill 0.33)
  Top 0.152: v27.2,15.85 31.55,11.51 31.55,11.35 J1.1 | v10.13,15.09 9.37,14.33 7.47,14.33 CN2.1
  Bottom 0.152: v27.2,15.85 24.16,15.85 22.94,17.07 15.54,17.07 13.14,14.67 | 13.14,14.67 13.11,14.63 13.11,13.56 JP1.1 | v10.13,15.09 12.73,15.09 13.14,14.67

### Text on the board
tPlace: Gen | RIFFLE | Lith/USB | v0.1.3 | + | IC2 | GND | VBUS | - | publiclab.org/riffle
bPlace: General | Riffle Beta 0.1.0 | TXD | RXD | publiclab.org/wiki/riffle | 3.7-6V | GND | CERN OHL v1.2 | Lithium | D5/RTC | 3.7V